# Altium project Li-ion_Battery_Charger.PrjPcb
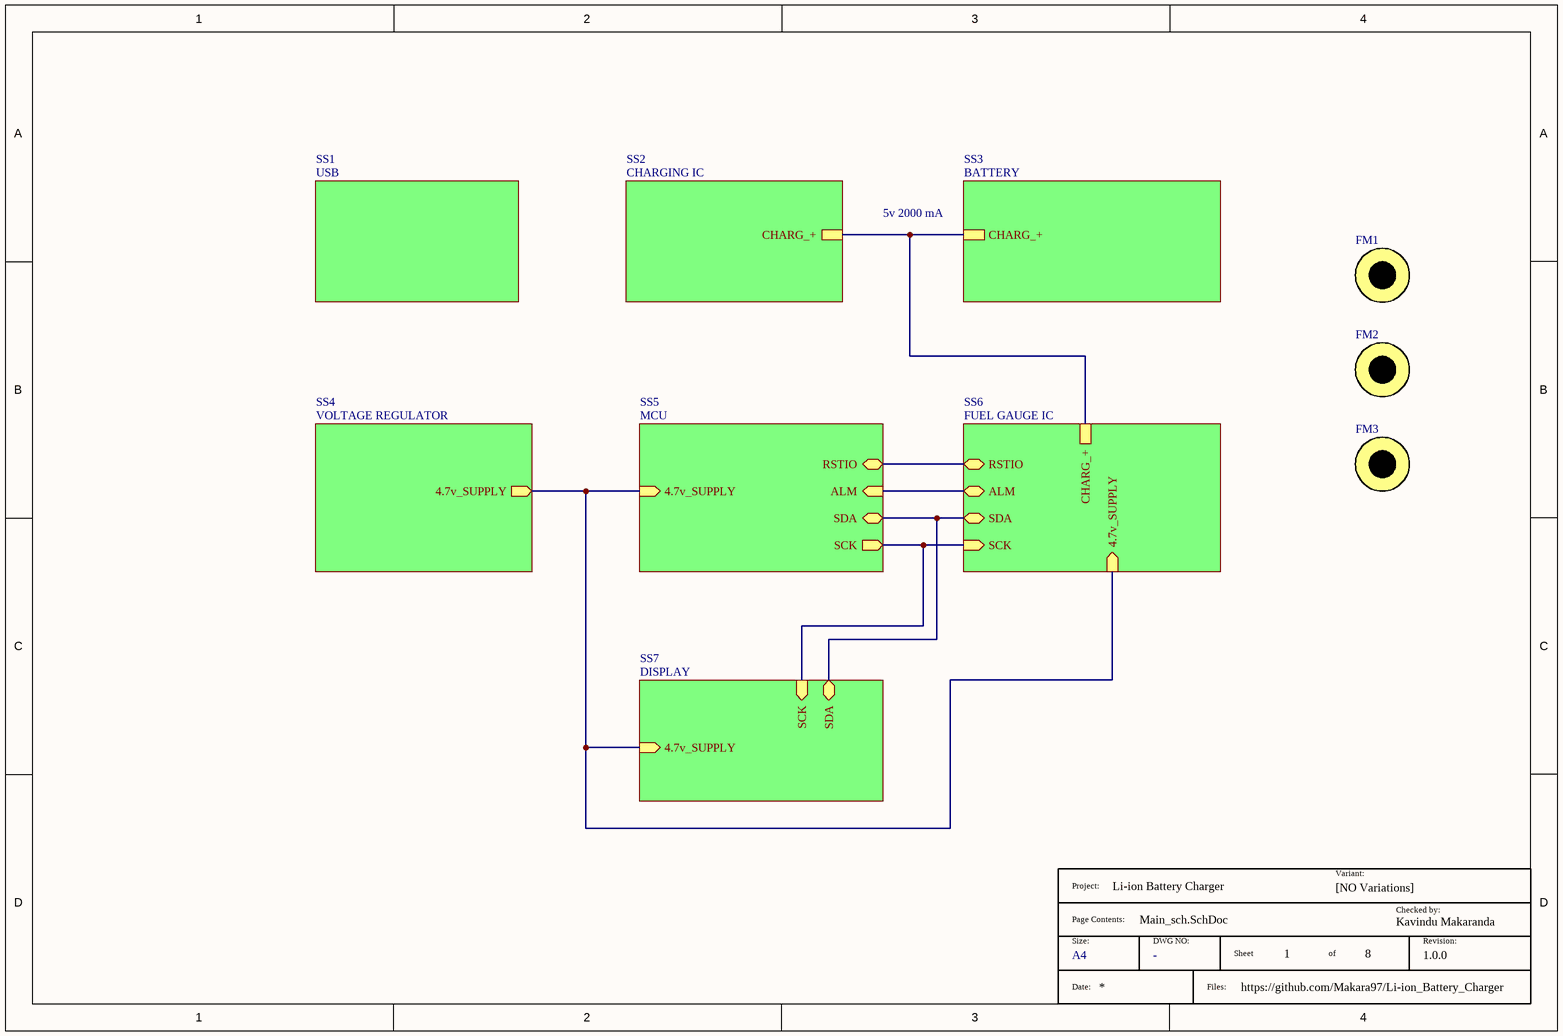
[diagram p0: Main_sch.SchDoc]
VersionRevision: 1.0.0; Project: Li-ion Battery Charger; DesignedByURL: https://github.com/Makara97/Li-ion_Battery_Charger
8 sheets, 47 parts. Net scope: hierarchical (ports join the sheet entries above them; power ports are global).
Board file: PCB.PcbDoc
Sheets:
  Main_sch.SchDoc
    SS1 = USB.SchDoc
    SS4 = VOLTAGE REGULATOR.SchDoc
    SS2 = CHARGING IC.SchDoc
    SS5 = MCU.SchDoc
    SS6 = FUEL GAUGE IC.SchDoc
    SS7 = DISPLAY.SchDoc
    SS3 = BATTERY.SchDoc

## Sheet Main_sch.SchDoc: Li-ion Battery Charger
size A4; Engineer: Kavindu Makaranda; Revision: 1.0.0; SheetNumber: 1; SheetTotal: 8

### Parts
*  Size: A4  (hidden comment: TitleBlock)  (graphical)
FM1  FIDUCIAL  [FIDUCIAL]  (value not drawn)
FM2  FIDUCIAL  [FIDUCIAL]  (value not drawn)
FM3  FIDUCIAL  [FIDUCIAL]  (value not drawn)

### Sub-sheets
SS1 = USB: no entries
SS2 = CHARGING IC: CHARG_+
SS3 = BATTERY: CHARG_+
SS4 = VOLTAGE REGULATOR: 4.7v_SUPPLY (out)
SS5 = MCU: SCK (out), SDA (bidir), ALM (in), RSTIO (bidir), 4.7v_SUPPLY (in)
SS6 = FUEL GAUGE IC: ALM (bidir), RSTIO (bidir), SDA (bidir), SCK (in), CHARG_+, 4.7v_SUPPLY (in)
SS7 = DISPLAY: 4.7v_SUPPLY (in), SCK (in), SDA (bidir)

### Nets
4.7v_SUPPLY: sheet SS4/4.7v_SUPPLY, sheet SS5/4.7v_SUPPLY, sheet SS6/4.7v_SUPPLY, sheet SS7/4.7v_SUPPLY
ALM: sheet SS5/ALM, sheet SS6/ALM
RSTIO: sheet SS5/RSTIO, sheet SS6/RSTIO
SCK: sheet SS5/SCK, sheet SS6/SCK, sheet SS7/SCK
SDA: sheet SS5/SDA, sheet SS6/SDA, sheet SS7/SDA
NetC2_2: sheet SS2/CHARG_+, sheet SS6/CHARG_+, sheet SS3/CHARG_+

### Notes on the sheet
- 5v 2000 mA
- THIS DOCUMENT AND THE DATA DISCLOSED HEREIN OR
- HEREWITH IS THE PROPERTY OF ALTIUM LIMITED AND MAY
- DWG NO:
- REVISION
- REV:
- DESCRIPTION
- DATE
- APPROVED
- BE FREELY DISTRIBUTED IN WHOLE. NO RIGHTS ARE
- RESERVED OR EXPRESS OR IMPLIED WARANTEE GIVEN.
- ENG:
- APPROVALS
- PROJECT
- DSN:
- CHK:
- REFERENCE DOCUMENTS
- PROJECT REVISION:
- TITLE
- DOCUMENT REVISION:
- DESIGN ITEM:
- BOM:
- FAB DWG:
- PCB DWG:
- ASSY DWG:
- SCALE:
- A3
- SIZE
- CAGE CODE
- FILE NAME
- DWG NO.
- SHEET
- OF
- REV
- (in symbol TitleBlock) Project:; Variant:; [NO Variations]; Checked by:; Page Contents:; Kavindu Makaranda; Size:; DWG NO:; Sheet; of; Revision:; Date:; Files:

### Library data of the parts
* = TitleBlock: Standard Title Block; DWG NO: -
FM1-FM3 = FM

## Sheet USB.SchDoc
size A4; SheetNumber: 2; SheetTotal: 8
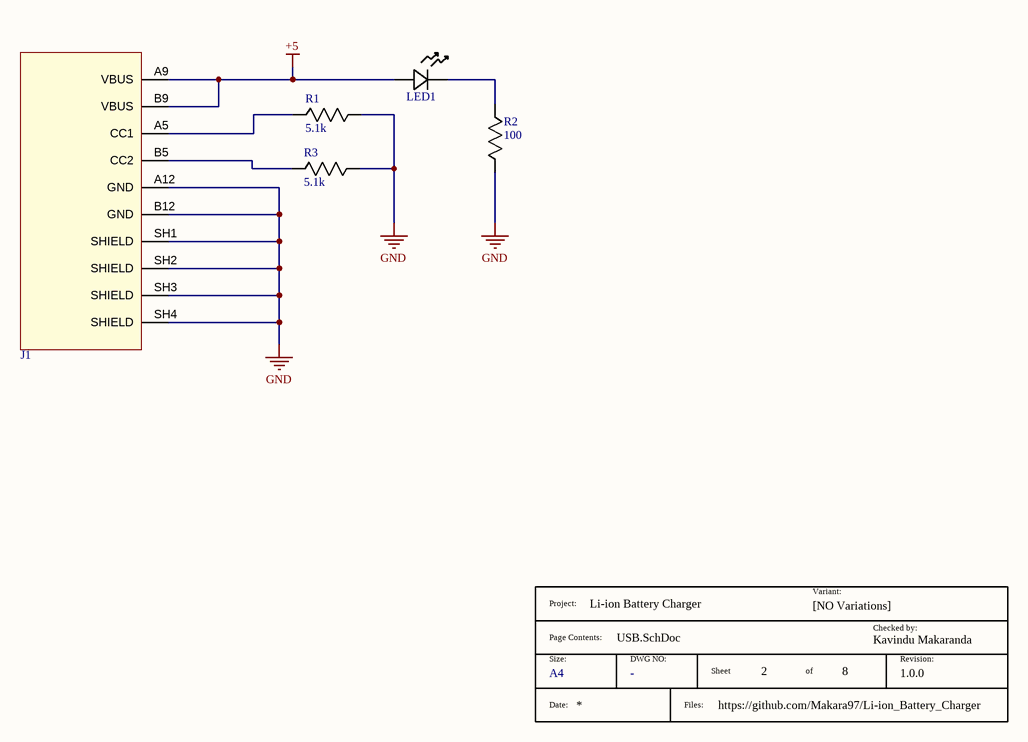
[diagram p1: USB.SchDoc]

### Parts
(Parts that share a designator on the sheet are numbered #1, #2 ... from top to bottom, then left to right.)
*?#1  Size: A4  (hidden comment: TitleBlock)  (graphical)
J1  USB_Type_C  [AMPHENOL_10174819-00011LF]  (value not drawn)
LED1  LED GREEN DIFFUSED 0603 SMD  [LED_B1931NG_HVK]  (value not drawn)
R1  5.1k  [RESC1608X55N]
R2  100  [RESC1608X55N]
R3  5.1k  [RESC1608X55N]

### Nets
+5: J1.A9(VBUS) J1.B9(VBUS) LED1.2(ANODE)
GND: J1.A12(GND) J1.B12(GND) J1.SH1(SHIELD) J1.SH2(SHIELD) J1.SH3(SHIELD) J1.SH4(SHIELD) R1.2 R2.1 R3.2
NetJ1_A5: J1.A5(CC1) R1.1
NetJ1_B5: J1.B5(CC2) R3.1
NetLED1_1: LED1.1(CATHODE) R2.2

### Notes on the sheet
- THIS DOCUMENT AND THE DATA DISCLOSED HEREIN OR
- HEREWITH IS THE PROPERTY OF ALTIUM LIMITED AND MAY
- DWG NO:
- REVISION
- REV:
- DESCRIPTION
- DATE
- APPROVED
- BE FREELY DISTRIBUTED IN WHOLE. NO RIGHTS ARE
- RESERVED OR EXPRESS OR IMPLIED WARANTEE GIVEN.
- ENG:
- APPROVALS
- PROJECT
- DSN:
- CHK:
- REFERENCE DOCUMENTS
- PROJECT REVISION:
- TITLE
- DOCUMENT REVISION:
- DESIGN ITEM:
- BOM:
- FAB DWG:
- PCB DWG:
- ASSY DWG:
- SCALE:
- A3
- SIZE
- CAGE CODE
- FILE NAME
- DWG NO.
- SHEET
- OF
- REV
- (in symbol TitleBlock) Project:; Variant:; [NO Variations]; Checked by:; Page Contents:; Kavindu Makaranda; Size:; DWG NO:; Sheet; of; Revision:; Date:; Files:

### Library data of the parts
*?#1 = TitleBlock: Standard Title Block; DWG NO: -
J1 = 10174819-00011LF: USB-C (USB TYPE-C) Receptacle Connector 24 (6+18 Dummy) Position Surface Mount, Right Angle; MF: Amphenol Communications Solutions-FCI; SnapEDA_Link: https://www.snapeda.com/parts/10174819-00011LF/Amphenol/view-part/?ref=snap; Package: None; Value: *; MP: 10174819-00011LF; Check_prices: https://www.snapeda.com/parts/10174819-00011LF/Amphenol/view-part/?ref=eda; Supplier 1: Digikey; Supplier Part Number 1: 609-10174819-00011LFCT-ND
LED1 = B1931NG--20D001114U1930: Mfr_Name: Harvatek; Type: LED Indication; Supplier 1: Digikey; Supplier Part Number 1: 3147-B1931NG--20D001114U1930CT-ND
R1 R3 = RC0603FR-075K1L: Resistor RC0603FR-075K1L; Manufacturer_Name: KEMET; Datasheet Link: http://www.yageo.com/documents/recent/PYu-RC0603_51_RoHS_L_v5.pdf; Height: 0.55mm; Manufacturer_Part_Number: RC0603FR-075K1L; Mouser Part Number: 603-RC0603FR-075K1L; Mouser Price/Stock: https://www.mouser.co.uk/ProductDetail/YAGEO/RC0603FR-075K1L?qs=gt6vzsuosg2jUUwxnI2PJQ%3D%3D; Arrow Part Number: RC0603FR-075K1L; Arrow Price/Stock: https://www.arrow.com/en/products/rc0603fr-075k1l/yageo?region=nac; Supplier 1: Digikey; Supplier Part Number 1: 311-5.10KHRCT-ND
R2 = ERJ-3EKF1000V: Resistor ERJ-3EKF1000V; Manufacturer_Name: Panasonic; Datasheet Link: http://industrial.panasonic.com/cdbs/www-data/pdf/RDA0000/AOA0000C86.pdf; Height: 0.55mm; Manufacturer_Part_Number: ERJ-3EKF1000V; Mouser Part Number: 667-ERJ-3EKF1000V; Mouser Price/Stock: https://www.mouser.co.uk/ProductDetail/Panasonic/ERJ-3EKF1000V?qs=H7k1u0Mp9JS7i8KGO5m47A%3D%3D; Arrow Part Number: ERJ-3EKF1000V; Arrow Price/Stock: https://www.arrow.com/en/products/erj-3ekf1000v/panasonic?utm_currency=USD&region=nac; Supplier 1: Mouser; Supplier Part Number 1: 667-ERJ-3EKF1000V

## Sheet VOLTAGE REGULATOR.SchDoc
size A4; SheetNumber: 5; SheetTotal: 8
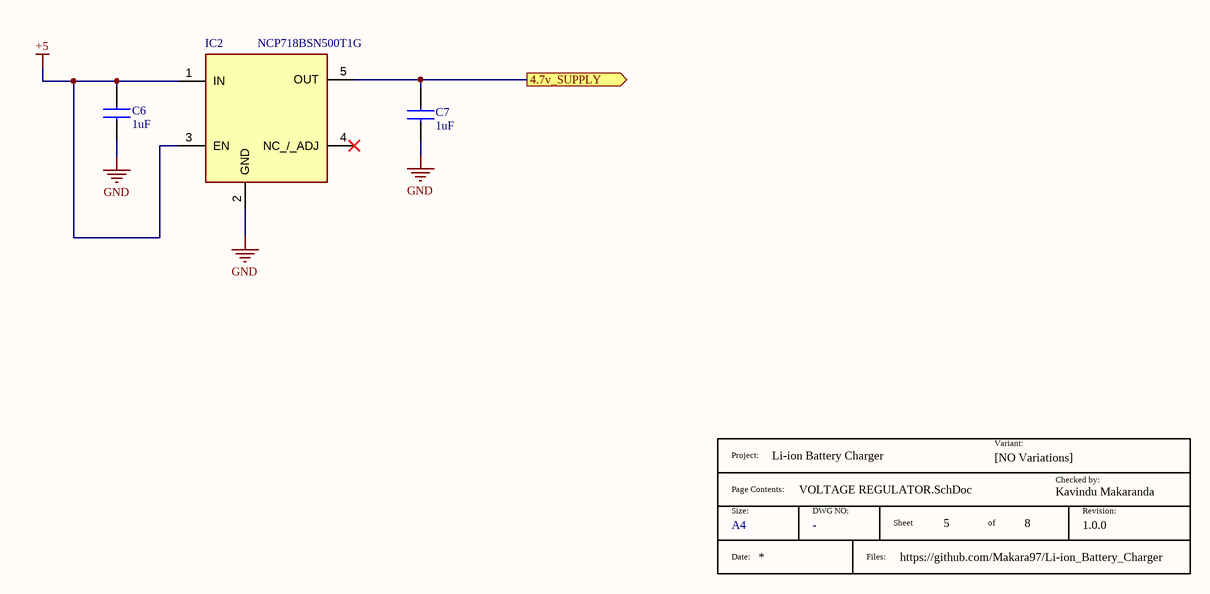
[diagram p2: VOLTAGE REGULATOR.SchDoc]

### Parts
(Parts that share a designator on the sheet are numbered #1, #2 ... from top to bottom, then left to right.)
*?#2  Size: A4  (hidden comment: TitleBlock)  (graphical)
C6  1uF  [CAPC1608X90N]
C7  1uF  [CAPC1608X90N]
IC2  NCP718BSN500T1G  [SOT95P280X100-5N]

### Ports
4.7v_SUPPLY (out, see Main_sch[2B], DISPLAY[2C], FUEL GAUGE IC[1B], MCU[3A])

### Nets
+5: C6.2 IC2.1(IN) IC2.3(EN)
GND: C6.1 C7.1 IC2.2(GND)
4.7v_SUPPLY: C7.2 IC2.5(OUT) ; port 4.7v_SUPPLY

Not connected (* = marked no-connect by the designer): IC2 4(NC_/_ADJ)*

### Notes on the sheet
- THIS DOCUMENT AND THE DATA DISCLOSED HEREIN OR
- HEREWITH IS THE PROPERTY OF ALTIUM LIMITED AND MAY
- DWG NO:
- REVISION
- REV:
- DESCRIPTION
- DATE
- APPROVED
- BE FREELY DISTRIBUTED IN WHOLE. NO RIGHTS ARE
- RESERVED OR EXPRESS OR IMPLIED WARANTEE GIVEN.
- ENG:
- APPROVALS
- PROJECT
- DSN:
- CHK:
- REFERENCE DOCUMENTS
- PROJECT REVISION:
- TITLE
- DOCUMENT REVISION:
- DESIGN ITEM:
- BOM:
- FAB DWG:
- PCB DWG:
- ASSY DWG:
- SCALE:
- A3
- SIZE
- CAGE CODE
- FILE NAME
- DWG NO.
- SHEET
- OF
- REV
- (in symbol TitleBlock) Project:; Variant:; [NO Variations]; Checked by:; Page Contents:; Kavindu Makaranda; Size:; DWG NO:; Sheet; of; Revision:; Date:; Files:

### Library data of the parts
*?#2 = TitleBlock: Standard Title Block; DWG NO: -
C6 C7 = CL10A105KO8NNNC: Manufacturer_Name: SAMSUNG; Datasheet Link: https://labcenter.componentsearchengine.com/Datasheets/2/CL10A105KO8NNNC.pdf; Height: 0.9mm; Manufacturer_Part_Number: CL10A105KO8NNNC; Mouser Part Number: 187-CL10A105KO8NNNC; Mouser Price/Stock: https://www.mouser.co.uk/ProductDetail/Samsung-Electro-Mechanics/CL10A105KO8NNNC?qs=hqM3L16%252BxlfR4qamq4FMLg%3D%3D; Arrow Part Number: CL10A105KO8NNNC; Arrow Price/Stock: https://www.arrow.com/en/products/cl10a105ko8nnnc/samsung-electro-mechanics?utm_currency=USD&region=nac; Supplier 1: Digikey; Supplier Part Number 1: 1276-1034-1-ND
IC2 = NCP718BSN500T1G: Integrated Circuit; Manufacturer_Name: onsemi; Datasheet Link: https://www.onsemi.com/pub/Collateral/NCP718-D.PDF; Height: 1mm; Manufacturer_Part_Number: NCP718BSN500T1G; Mouser Part Number: 863-NCP718BSN500T1G; Mouser Price/Stock: https://www.mouser.co.uk/ProductDetail/onsemi/NCP718BSN500T1G?qs=MLItCLRbWsy0K4chDaw%252BGA%3D%3D; Arrow Part Number: NCP718BSN500T1G; Arrow Price/Stock: https://www.arrow.com/en/products/ncp718bsn500t1g/on-semiconductor?region=nac; Supplier 1: Arrow Electronics; Supplier Part Number 1: NCP718BSN500T1G

## Sheet CHARGING IC.SchDoc
size A4; SheetNumber: 3; SheetTotal: 8
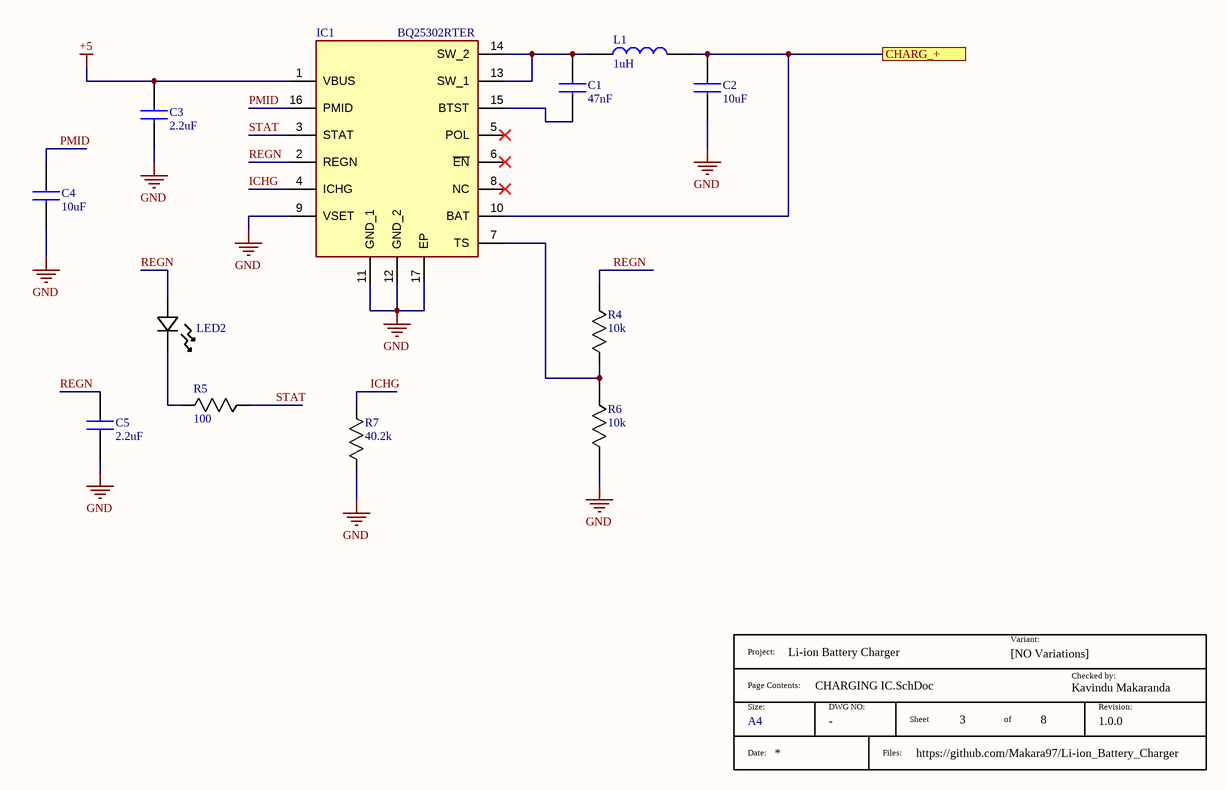
[diagram p3: CHARGING IC.SchDoc]

### Parts
(Parts that share a designator on the sheet are numbered #1, #2 ... from top to bottom, then left to right.)
*?#3  Size: A4  (hidden comment: TitleBlock)  (graphical)
C1  47nF  [C0603]
C2  10uF  [CAPC1608X90N]
C3  2.2uF  [CAPC1608X90N]
C4  10uF  [CAPC1608X90N]
C5  2.2uF  [CAPC1608X90N]
IC1  BQ25302RTER  [QFN50P300X300X80-17N-D]
L1  1uH  [INDC2016X100N]
LED2  LED GREEN DIFFUSED 0603 SMD  [LED_B1931NG_HVK]  (value not drawn)
R4  10k  [RESC1608X55N]
R5  100  [RESC1608X55N]
R6  10k  [RESC1608X55N]
R7  40.2k  [STA_RMCF0805_STP-L]

### Ports
CHARG_+ (see Main_sch[3A], BATTERY[2B], FUEL GAUGE IC[4B])

### Nets
+5: C3.2 IC1.1(VBUS)
GND: C2.1 C3.1 C4.1 C5.1 IC1.9(VSET) IC1.11(GND_1) IC1.12(GND_2) IC1.17(EP) R6.1 R7.1
ICHG: IC1.4(ICHG) R7.2
PMID: C4.2 IC1.16(PMID)
REGN: C5.2 IC1.2(REGN) LED2.2(ANODE) R4.2
STAT: IC1.3(STAT) R5.2
NetC1_1: C1.1 IC1.15(BTST)
NetC1_2: C1.2 IC1.13(SW_1) IC1.14(SW_2) L1.1
NetC2_2: C2.2 IC1.10(BAT) L1.2 ; port CHARG_+
NetIC1_7: IC1.7(TS) R4.1 R6.2
NetLED2_1: LED2.1(CATHODE) R5.1

Not connected (* = marked no-connect by the designer): IC1 5(POL)* 6(~{EN})* 8(NC)*

### Notes on the sheet
- THIS DOCUMENT AND THE DATA DISCLOSED HEREIN OR
- HEREWITH IS THE PROPERTY OF ALTIUM LIMITED AND MAY
- DWG NO:
- REVISION
- REV:
- DESCRIPTION
- DATE
- APPROVED
- BE FREELY DISTRIBUTED IN WHOLE. NO RIGHTS ARE
- RESERVED OR EXPRESS OR IMPLIED WARANTEE GIVEN.
- ENG:
- APPROVALS
- PROJECT
- DSN:
- CHK:
- REFERENCE DOCUMENTS
- PROJECT REVISION:
- TITLE
- DOCUMENT REVISION:
- DESIGN ITEM:
- BOM:
- FAB DWG:
- PCB DWG:
- ASSY DWG:
- SCALE:
- A3
- SIZE
- CAGE CODE
- FILE NAME
- DWG NO.
- SHEET
- OF
- REV
- (in symbol TitleBlock) Variant:; Project:; [NO Variations]; Checked by:; Page Contents:; Kavindu Makaranda; Size:; DWG NO:; Revision:; Sheet; of; Date:; Files:

### Library data of the parts
*?#3 = TitleBlock: Standard Title Block; DWG NO: -
C1 = C0603C473K4RECAUTO: Manufacturer_Name: KEMET; Datasheet Link: https://content.kemet.com/datasheets/KEM_C1090_X7R_ESD.pdf; Height: 0.87mm; Manufacturer_Part_Number: C0603C473K4RECAUTO; Mouser Part Number: 80-C0603C473K4RECAUT; Mouser Price/Stock: https://www.mouser.co.uk/ProductDetail/KEMET/C0603C473K4RECAUTO?qs=MLItCLRbWsx7WtjsOHG43w%3D%3D; Supplier 1: Arrow Electronics; Supplier Part Number 1: C0603C473K4RECAUTO
C2 C4 = CL10A106KQ8NNNC: Manufacturer_Name: SAMSUNG; Datasheet Link: https://ms.componentsearchengine.com/Datasheets/2/CL10A106KQ8NNNC.pdf; Height: 0.9mm; Manufacturer_Part_Number: CL10A106KQ8NNNC; Mouser Part Number: 187-CL10A106KQ8NNNC; Mouser Price/Stock: https://www.mouser.co.uk/ProductDetail/Samsung-Electro-Mechanics/CL10A106KQ8NNNC?qs=349EhDEZ59o8RdV9CD4bGw%3D%3D; Arrow Part Number: CL10A106KQ8NNNC; Arrow Price/Stock: https://www.arrow.com/en/products/cl10a106kq8nnnc/samsung-electro-mechanics?utm_currency=USD&region=nac; Supplier 1: Digikey; Supplier Part Number 1: 1276-1038-1-ND
C3 C5 = CL10A225KO8NNNC: Manufacturer_Name: SAMSUNG; Datasheet Link: https://lcsc.componentsearchengine.com/Datasheets/2/CL10A225KO8NNNC.pdf; Height: 0.9mm; Manufacturer_Part_Number: CL10A225KO8NNNC; Mouser Part Number: 187-CL10A225KO8NNNC; Mouser Price/Stock: https://www.mouser.co.uk/ProductDetail/Samsung-Electro-Mechanics/CL10A225KO8NNNC?qs=hqM3L16%252BxlecoJxUp5hKOw%3D%3D; Arrow Part Number: CL10A225KO8NNNC; Arrow Price/Stock: https://www.arrow.com/en/products/cl10a225ko8nnnc/samsung-electro-mechanics?region=europe; Supplier 1: Digikey; Supplier Part Number 1: 1276-1040-1-ND
IC1 = BQ25302RTER: Integrated Circuit; Manufacturer_Name: Texas Instruments; Datasheet Link: https://www.ti.com/lit/gpn/bq25302?HQS=ti-null-null-sf-df-pf-sep-wwe&DCM=yes; Height: 0.8mm; Manufacturer_Part_Number: BQ25302RTER; Mouser Part Number: 595-BQ25302RTER; Mouser Price/Stock: https://www.mouser.co.uk/ProductDetail/Texas-Instruments/BQ25302RTER?qs=T94vaHKWudT5T0v43I60Mg%3D%3D; Arrow Part Number: BQ25302RTER; Arrow Price/Stock: null?region=nac; Supplier 1: Mouser; Supplier Part Number 1: 595-BQ25302RTER
L1 = CIGT201610LH1R0MNE: Manufacturer_Name: SAMSUNG; Datasheet Link: https://datasheet.datasheetarchive.com/originals/distributors/DKDS-19/372470.pdf; Height: 1mm; Manufacturer_Part_Number: CIGT201610LH1R0MNE; Mouser Part Number: 187-CIGT201610LH1R0M; Mouser Price/Stock: https://www.mouser.co.uk/ProductDetail/Samsung-Electro-Mechanics/CIGT201610LH1R0MNE?qs=xZ%2FP%252Ba9zWqYdDsZ4M%252BqcTg%3D%3D; Arrow Part Number: CIGT201610LH1R0MNE; Arrow Price/Stock: https://www.arrow.com/en/products/cigt201610lh1r0mne/samsung-electro-mechanics?utm_currency=USD&region=nac; Supplier 1: Digikey; Supplier Part Number 1: 1276-6910-1-ND
LED2 = B1931NG--20D001114U1930: Mfr_Name: Harvatek; Type: LED Indication; Supplier 1: Digikey; Supplier Part Number 1: 3147-B1931NG--20D001114U1930CT-ND
R4 R6 = RK73H1JTTD1002F: Manufacturer_Name: KOA Speer; Datasheet Link: http://www.koaspeer.com/catimages/Products/RK73-RT/RK73-RT.pdf; Height: 0.55mm; Manufacturer_Part_Number: RK73H1JTTD1002F; Mouser Part Number: 660-RK73H1JTTD1002F; Mouser Price/Stock: https://www.mouser.co.uk/ProductDetail/KOA-Speer/RK73H1JTTD1002F?qs=%252BHd4ebZ%252Bq6V15kIYdKv25A%3D%3D; Arrow Part Number: RK73H1JTTD1002F; Arrow Price/Stock: https://www.arrow.com/en/products/rk73h1jttd1002f/koa-speer-electronics?region=nac; Supplier 1: Digikey; Supplier Part Number 1: 2019-RK73H1JTTD1002FCT-ND
R5 = ERJ-3EKF1000V: as R2 on sheet USB; Datasheet Link: http://industrial.panasonic.com/cdbs/www-data/pdf/RDA0000/AOA0000C86.pdf; Height: 0.55mm; Manufacturer_Part_Number: ERJ-3EKF1000V; Mouser Part Number: 667-ERJ-3EKF1000V; Mouser Price/Stock: https://www.mouser.co.uk/ProductDetail/Panasonic/ERJ-3EKF1000V?qs=H7k1u0Mp9JS7i8KGO5m47A%3D%3D; Arrow Part Number: ERJ-3EKF1000V; Arrow Price/Stock: https://www.arrow.com/en/products/erj-3ekf1000v/panasonic?utm_currency=USD&region=nac; Supplier 1: Mouser; Supplier Part Number 1: 667-ERJ-3EKF1000V
R7 = RMCF0805FT40K2: Mfr_Name: Stackpole International; Supplier 1: Digikey; Supplier Part Number 1: RMCF0805FT40K2CT-ND

## Sheet MCU.SchDoc
size A4; SheetNumber: 8; SheetTotal: 8
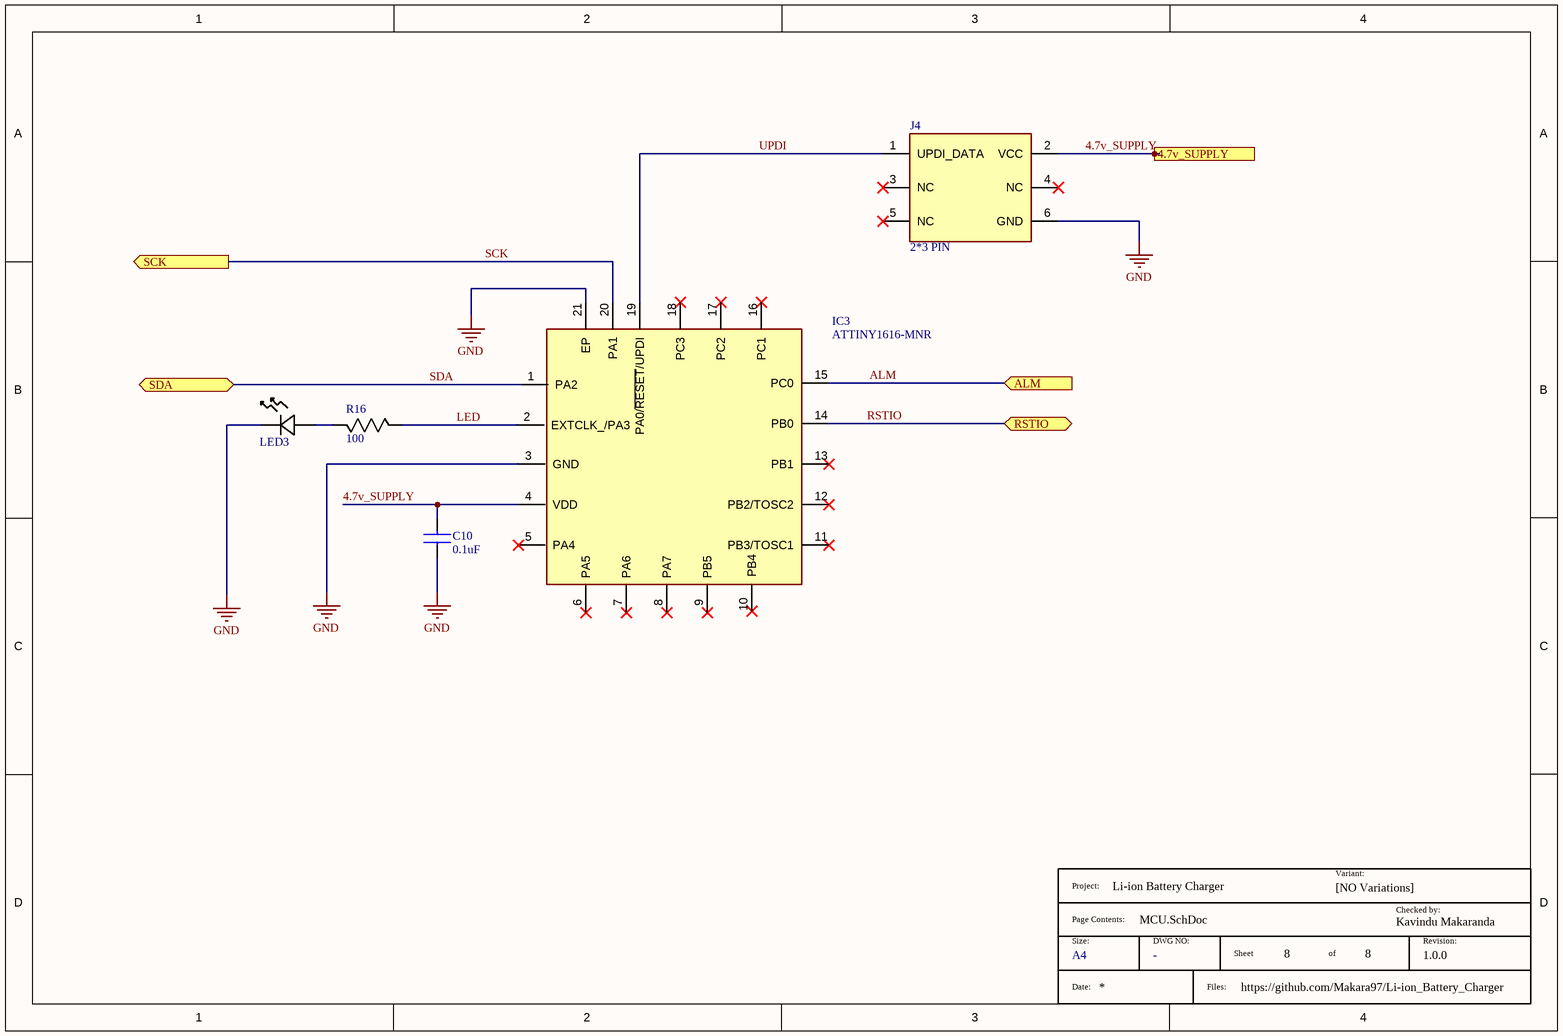
[diagram p4: MCU.SchDoc]

### Parts
(Parts that share a designator on the sheet are numbered #1, #2 ... from top to bottom, then left to right.)
*?#4  Size: A4  (hidden comment: TitleBlock)  (graphical)
C10  0.1uF  [C0603]
IC3  ATTINY1616-MNR  [QFN40P300X300X90-21N]
J4  2*3 PIN  [HDRV6W64P254_2X3_762X508X868P]
LED3  LED GREEN DIFFUSED 0603 SMD  [LED_B1931NG_HVK]  (value not drawn)
R16  100  [RESC1608X55N]

### Ports
4.7v_SUPPLY (in, see Main_sch[2B], DISPLAY[2C], FUEL GAUGE IC[1B], VOLTAGE REGULATOR[3B]), ALM (in, see Main_sch[3B], FUEL GAUGE IC[1B]), RSTIO (bidir, see Main_sch[3B], FUEL GAUGE IC[1C]), SCK (out, see Main_sch[3C], DISPLAY[2B], FUEL GAUGE IC[1B]), SDA (bidir, see Main_sch[3C], DISPLAY[2B], FUEL GAUGE IC[1B])

### Nets
GND: C10.1 IC3.3(GND) IC3.21(EP) J4.6(GND) LED3.1(CATHODE)
4.7v_SUPPLY: C10.2 IC3.4(VDD) J4.2(VCC) ; port 4.7v_SUPPLY
ALM: IC3.15(PC0) ; port ALM
LED: IC3.2(EXTCLK_/PA3) R16.1
RSTIO: IC3.14(PB0) ; port RSTIO
SCK: IC3.20(PA1) ; port SCK
SDA: IC3.1(PA2) ; port SDA
UPDI: IC3.19(PA0/~{RESET}/UPDI) J4.1(UPDI_DATA)
NetLED3_2: LED3.2(ANODE) R16.2

Not connected (* = marked no-connect by the designer): IC3 5(PA4)* 6(PA5)* 7(PA6)* 8(PA7)* 9(PB5)* 10(PB4)* 11(PB3/TOSC1)* 12(PB2/TOSC2)* 13(PB1)* 16(PC1)* 17(PC2)* 18(PC3)*; J4 3(NC)* 4(NC)* 5(NC)*

### Notes on the sheet
- THIS DOCUMENT AND THE DATA DISCLOSED HEREIN OR
- HEREWITH IS THE PROPERTY OF ALTIUM LIMITED AND MAY
- DWG NO:
- REVISION
- REV:
- DESCRIPTION
- DATE
- APPROVED
- BE FREELY DISTRIBUTED IN WHOLE. NO RIGHTS ARE
- RESERVED OR EXPRESS OR IMPLIED WARANTEE GIVEN.
- ENG:
- APPROVALS
- PROJECT
- DSN:
- CHK:
- REFERENCE DOCUMENTS
- PROJECT REVISION:
- TITLE
- DOCUMENT REVISION:
- DESIGN ITEM:
- BOM:
- FAB DWG:
- PCB DWG:
- ASSY DWG:
- SCALE:
- A3
- SIZE
- CAGE CODE
- FILE NAME
- DWG NO.
- SHEET
- OF
- REV
- (in symbol TitleBlock) Project:; Variant:; [NO Variations]; Checked by:; Page Contents:; Kavindu Makaranda; Size:; DWG NO:; Sheet; of; Revision:; Date:; Files:

### Library data of the parts
*?#4 = TitleBlock: Standard Title Block; DWG NO: -
C10 = C0603C104K3RACTU: Capacitor C0603C104K3RACTU; Manufacturer_Name: KEMET; Datasheet Link: https://content.kemet.com/datasheets/KEM_C1002_X7R_SMD.pdf; Height: 0.87mm; Manufacturer_Part_Number: C0603C104K3RACTU; Mouser Part Number: 80-C0603C104K3R; Mouser Price/Stock: https://www.mouser.co.uk/ProductDetail/KEMET/C0603C104K3RACTU?qs=l5k%252BbMnNDklvfdneglCDAg%3D%3D; Arrow Part Number: C0603C104K3RACTU; Arrow Price/Stock: https://www.arrow.com/en/products/c0603c104k3ractu/kemet-corporation?utm_currency=USD&region=nac; Supplier 1: Arrow Electronics; Supplier Part Number 1: C0603C104K3RACTU
IC3 = ATTINY1616-MNR: Integrated Circuit ATTINY1616-MNR; Manufacturer_Name: Microchip; Datasheet Link: https://datasheet.datasheetarchive.com/originals/distributors/DKDS41/DSANUWW0026757.pdf; Height: 0.9mm; Manufacturer_Part_Number: ATTINY1616-MNR; Mouser Part Number: 556-ATTINY1616MNR; Mouser Price/Stock: https://www.mouser.co.uk/ProductDetail/Microchip-Technology/ATTINY1616-MNR?qs=HXFqYaX1Q2yKNpuKQU9qww%3D%3D; Arrow Part Number: ATTINY1616-MNR; Arrow Price/Stock: https://www.arrow.com/en/products/attiny1616-mnr/microchip-technology?utm_currency=USD&region=nac; Supplier 1: Digikey; Supplier Part Number 1: ATTINY1616-MNRCT-ND
J4 = M20-9980346: Connector; Manufacturer_Name: Harwin; Datasheet Link: https://cdn.harwin.com/pdfs/M20-998.pdf; Height: 8.68mm; Manufacturer_Part_Number: M20-9980346; Mouser Part Number: 855-M20-9980346; Mouser Price/Stock: https://www.mouser.co.uk/ProductDetail/Harwin/M20-9980346?qs=%252Bk6%2F5FB6qrmHk2P20oz3FA%3D%3D; Supplier 1: Digikey; Supplier Part Number 1: 952-2121-ND
LED3 = B1931NG--20D001114U1930: Mfr_Name: Harvatek; Type: LED Indication; Supplier 1: Digikey; Supplier Part Number 1: 3147-B1931NG--20D001114U1930CT-ND
R16 = ERJ-3EKF1000V: as R2 on sheet USB; Datasheet Link: http://industrial.panasonic.com/cdbs/www-data/pdf/RDA0000/AOA0000C86.pdf; Height: 0.55mm; Manufacturer_Part_Number: ERJ-3EKF1000V; Mouser Part Number: 667-ERJ-3EKF1000V; Mouser Price/Stock: https://www.mouser.co.uk/ProductDetail/Panasonic/ERJ-3EKF1000V?qs=H7k1u0Mp9JS7i8KGO5m47A%3D%3D; Arrow Part Number: ERJ-3EKF1000V; Arrow Price/Stock: https://www.arrow.com/en/products/erj-3ekf1000v/panasonic?utm_currency=USD&region=nac; Supplier 1: Mouser; Supplier Part Number 1: 667-ERJ-3EKF1000V

## Sheet FUEL GAUGE IC.SchDoc
size A4; SheetNumber: 7; SheetTotal: 8
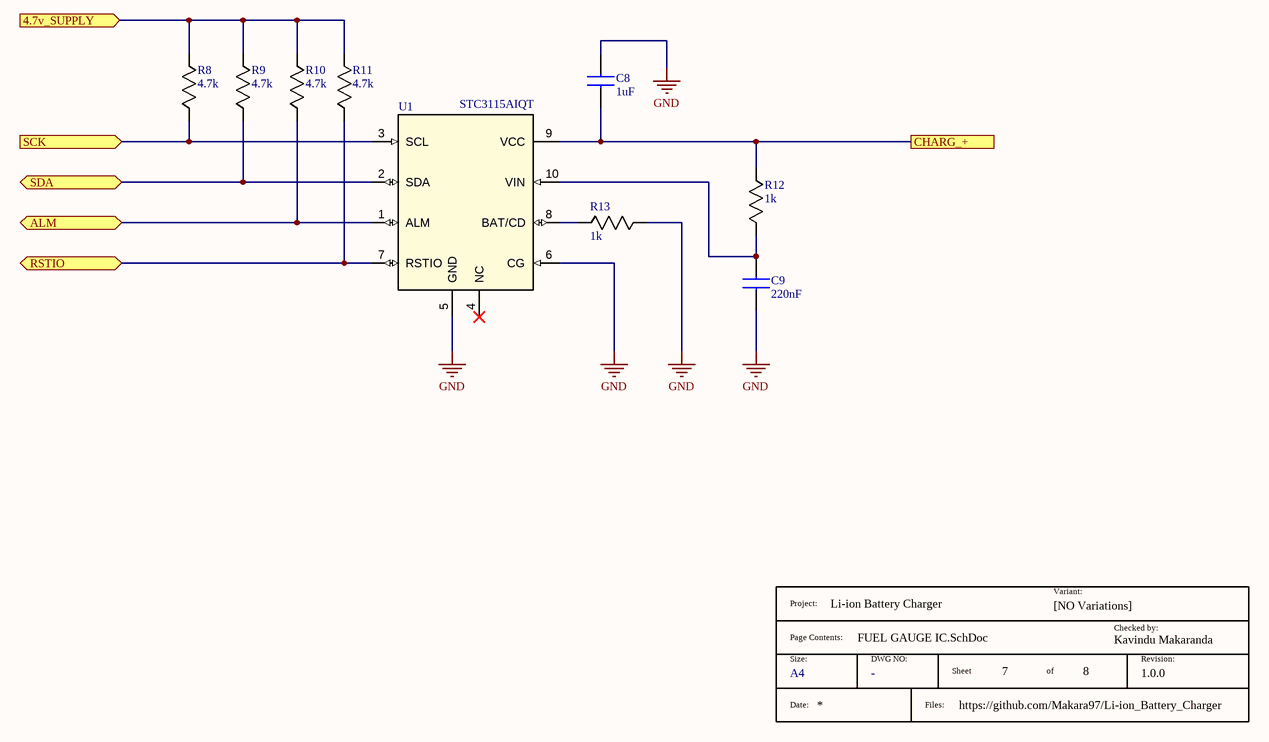
[diagram p5: FUEL GAUGE IC.SchDoc]

### Parts
(Parts that share a designator on the sheet are numbered #1, #2 ... from top to bottom, then left to right.)
*?#5  Size: A4  (hidden comment: TitleBlock)  (graphical)
C8  1uF  [CAPC1608X90N]
C9  220nF  [C0603]
R8  4.7k  [RESC1608X55N]
R9  4.7k  [RESC1608X55N]
R10  4.7k  [RESC1608X55N]
R11  4.7k  [RESC1608X55N]
R12  1k  [RESC1608X55N]
R13  1k  [RESC1608X55N]
U1  STC3115AIQT  [DFN10_2X3_STM]

### Ports
4.7v_SUPPLY (in, see Main_sch[3C], DISPLAY[2C], MCU[3A], VOLTAGE REGULATOR[3B]), ALM (bidir, see Main_sch[3B], MCU[3B]), CHARG_+ (see Main_sch[3B], BATTERY[2B], CHARGING IC[4B]), RSTIO (bidir, see Main_sch[3B], MCU[3B]), SCK (in, see Main_sch[3C], DISPLAY[2B], MCU[1B]), SDA (bidir, see Main_sch[3C], DISPLAY[2B], MCU[1B])

### Nets
GND: C8.2 C9.1 R13.2 U1.5(GND) U1.6(CG)
4.7v_SUPPLY: R8.2 R9.2 R10.2 R11.2 ; port 4.7v_SUPPLY
ALM: R10.1 U1.1(ALM) ; port ALM
RSTIO: R11.1 U1.7(RSTIO) ; port RSTIO
SCK: R8.1 U1.3(SCL) ; port SCK
SDA: R9.1 U1.2(SDA) ; port SDA
NetC2_2: C8.1 R12.2 U1.9(VCC) ; port CHARG_+
NetC9_2: C9.2 R12.1 U1.10(VIN)
NetR13_1: R13.1 U1.8(BAT/CD)

Not connected (* = marked no-connect by the designer): U1 4(NC)*

### Notes on the sheet
- THIS DOCUMENT AND THE DATA DISCLOSED HEREIN OR
- HEREWITH IS THE PROPERTY OF ALTIUM LIMITED AND MAY
- DWG NO:
- REVISION
- REV:
- DESCRIPTION
- DATE
- APPROVED
- BE FREELY DISTRIBUTED IN WHOLE. NO RIGHTS ARE
- RESERVED OR EXPRESS OR IMPLIED WARANTEE GIVEN.
- ENG:
- APPROVALS
- PROJECT
- DSN:
- CHK:
- REFERENCE DOCUMENTS
- PROJECT REVISION:
- TITLE
- DOCUMENT REVISION:
- DESIGN ITEM:
- BOM:
- FAB DWG:
- PCB DWG:
- ASSY DWG:
- SCALE:
- A3
- SIZE
- CAGE CODE
- FILE NAME
- DWG NO.
- SHEET
- OF
- REV
- (in symbol TitleBlock) Project:; Variant:; [NO Variations]; Checked by:; Page Contents:; Kavindu Makaranda; Size:; DWG NO:; Sheet; of; Revision:; Date:; Files:

### Library data of the parts
*?#5 = TitleBlock: Standard Title Block; DWG NO: -
C8 = CL10A105KO8NNNC: Manufacturer_Name: SAMSUNG; Datasheet Link: https://labcenter.componentsearchengine.com/Datasheets/2/CL10A105KO8NNNC.pdf; Height: 0.9mm; Manufacturer_Part_Number: CL10A105KO8NNNC; Mouser Part Number: 187-CL10A105KO8NNNC; Mouser Price/Stock: https://www.mouser.co.uk/ProductDetail/Samsung-Electro-Mechanics/CL10A105KO8NNNC?qs=hqM3L16%252BxlfR4qamq4FMLg%3D%3D; Arrow Part Number: CL10A105KO8NNNC; Arrow Price/Stock: https://www.arrow.com/en/products/cl10a105ko8nnnc/samsung-electro-mechanics?utm_currency=USD&region=nac; Supplier 1: Digikey; Supplier Part Number 1: 1276-1034-1-ND
C9 = C0603C224K4RECAUTO: Capacitor C0603C224K4RECAUTO; Manufacturer_Name: KEMET; Datasheet Link: https://content.kemet.com/datasheets/KEM_C1090_X7R_ESD.pdf; Height: 0.87mm; Manufacturer_Part_Number: C0603C224K4RECAUTO; Mouser Part Number: 80-C0603C224K4RECAUT; Mouser Price/Stock: https://www.mouser.co.uk/ProductDetail/KEMET/C0603C224K4RECAUTO?qs=MLItCLRbWszB36u3S8vAZQ%3D%3D; Arrow Part Number: C0603C224K4RECAUTO; Arrow Price/Stock: https://www.arrow.com/en/products/c0603c224k4recauto/kemet-corporation?region=nac; Supplier 1: Arrow Electronics; Supplier Part Number 1: C0603C224K4RECAUTO
R8-R11 = RC0603FR-074K7L: Resistor RC0603FR-074K7L; Manufacturer_Name: YAGEO; Datasheet Link: https://componentsearchengine.com/Datasheets/2/RC0603FR-074K7L.pdf; Height: 0.55mm; Manufacturer_Part_Number: RC0603FR-074K7L; Mouser Part Number: 603-RC0603FR-074K7L; Mouser Price/Stock: https://www.mouser.co.uk/ProductDetail/YAGEO/RC0603FR-074K7L?qs=gt6vzsuosg37y0l7Vt36bQ%3D%3D; Arrow Part Number: RC0603FR-074K7L; Arrow Price/Stock: https://www.arrow.com/en/products/rc0603fr-074k7l/yageo?utm_currency=USD&region=europe; Supplier 1: Future Electronics; Supplier Part Number 1: 5489695
R12 R13 = RMCF0603FT1K00: Manufacturer_Name: Stackpole Electronics; Datasheet Link: https://www.seielect.com/Catalog/SEI-RMCF_RMCP.pdf; Height: 0.55mm; Manufacturer_Part_Number: RMCF0603FT1K00; Mouser Part Number: 708-RMCF0603FT1K00; Mouser Price/Stock: https://www.mouser.co.uk/ProductDetail/SEI-Stackpole/RMCF0603FT1K00?qs=FESYatJ8odI%252BYiPlprc1Pg%3D%3D; Arrow Part Number: RMCF0603FT1K00; Arrow Price/Stock: https://www.arrow.com/en/products/rmcf0603ft1k00/stackpole-electronics?utm_currency=USD&region=nac; Supplier 1: Digikey; Supplier Part Number 1: RMCF0603FT1K00CT-ND
U1 = STC3115AIQT: STC3115AIQT Fuel Gauge IC; Mfr_Name: STMicroelectronics; RefDes: RefDes; Type: Type; Supplier 1: Arrow Electronics; Supplier Part Number 1: STC3115AIQT

## Sheet DISPLAY.SchDoc
size A4; SheetNumber: 6; SheetTotal: 8
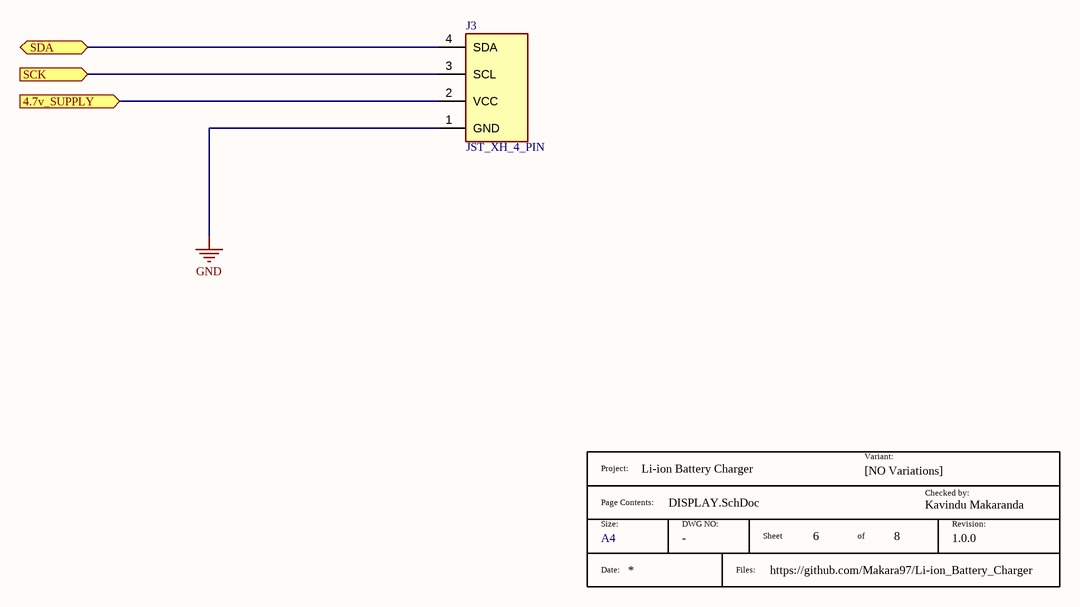
[diagram p6: DISPLAY.SchDoc]

### Parts
(Parts that share a designator on the sheet are numbered #1, #2 ... from top to bottom, then left to right.)
*?#6  Size: A4  (hidden comment: TitleBlock)  (graphical)
J3  JST_XH_4_PIN  [B4BXHALFSN]

### Ports
4.7v_SUPPLY (in, see Main_sch[2C], FUEL GAUGE IC[1B], MCU[3A], VOLTAGE REGULATOR[3B]), SCK (in, see Main_sch[3C], FUEL GAUGE IC[1B], MCU[1B]), SDA (bidir, see Main_sch[3C], FUEL GAUGE IC[1B], MCU[1B])

### Nets
GND: J3.1(GND)
4.7v_SUPPLY: J3.2(VCC) ; port 4.7v_SUPPLY
SCK: J3.3(SCL) ; port SCK
SDA: J3.4(SDA) ; port SDA

### Notes on the sheet
- THIS DOCUMENT AND THE DATA DISCLOSED HEREIN OR
- HEREWITH IS THE PROPERTY OF ALTIUM LIMITED AND MAY
- DWG NO:
- REVISION
- REV:
- DESCRIPTION
- DATE
- APPROVED
- BE FREELY DISTRIBUTED IN WHOLE. NO RIGHTS ARE
- RESERVED OR EXPRESS OR IMPLIED WARANTEE GIVEN.
- ENG:
- APPROVALS
- PROJECT
- DSN:
- CHK:
- REFERENCE DOCUMENTS
- PROJECT REVISION:
- TITLE
- DOCUMENT REVISION:
- DESIGN ITEM:
- BOM:
- FAB DWG:
- PCB DWG:
- ASSY DWG:
- SCALE:
- A3
- SIZE
- CAGE CODE
- FILE NAME
- DWG NO.
- SHEET
- OF
- REV
- (in symbol TitleBlock) Project:; Variant:; [NO Variations]; Checked by:; Page Contents:; Kavindu Makaranda; Size:; DWG NO:; Sheet; of; Revision:; Date:; Files:

### Library data of the parts
*?#6 = TitleBlock: Standard Title Block; DWG NO: -
J3 = B4B-XH-A_LF__SN_: Connector; Manufacturer_Name: JST (JAPAN SOLDERLESS TERMINALS); Manufacturer_Part_Number: B4B-XH-A(LF)(SN); Datasheet Link: https://datasheet.lcsc.com/szlcsc/JST-Sales-America-B4B-XH-A-LF-SN_C144395.pdf; Height: 7mm; Mouser Part Number: 306-B4BXHALFSN; Mouser Price/Stock: https://www.mouser.co.uk/ProductDetail/JST-Commercial/B4B-XH-ALFSN?qs=cdbOS8ANM9CfC08d%252BywhFw%3D%3D; Arrow Part Number: B4B-XH-A(LF)(SN); Arrow Price/Stock: https://www.arrow.com/en/products/b4b-xh-a-lf-sn/jst-manufacturing?utm_currency=USD&region=europe; Supplier 1: Mouser; Supplier Part Number 1: 306-B4BXHALFSN

## Sheet BATTERY.SchDoc
size A4; SheetNumber: 4; SheetTotal: 8
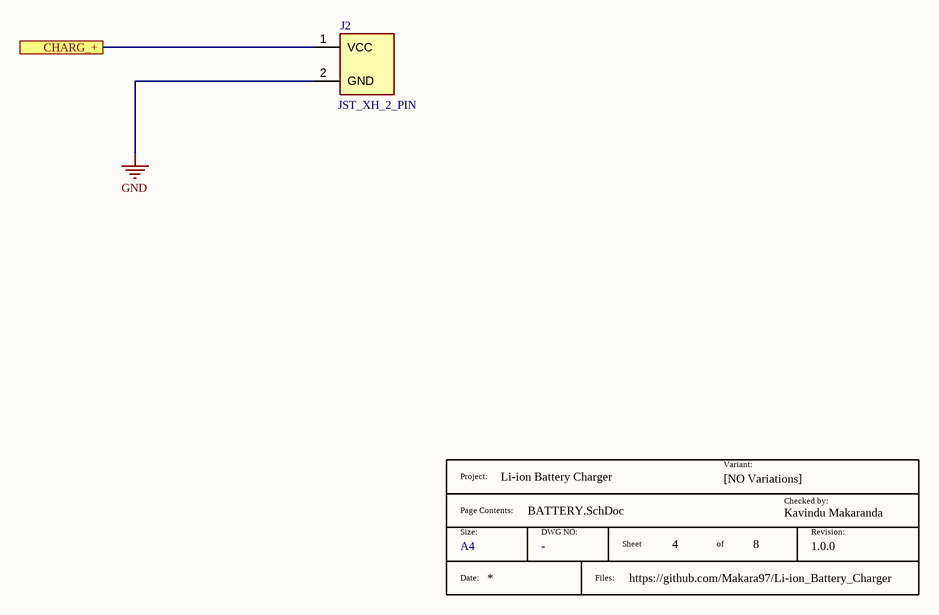
[diagram p7: BATTERY.SchDoc]

### Parts
(Parts that share a designator on the sheet are numbered #1, #2 ... from top to bottom, then left to right.)
*?#7  Size: A4  (hidden comment: TitleBlock)  (graphical)
J2  JST_XH_2_PIN  [B2BXHAGU]

### Ports
CHARG_+ (see Main_sch[3A], CHARGING IC[4B], FUEL GAUGE IC[4B])

### Nets
GND: J2.2(GND)
NetC2_2: J2.1(VCC) ; port CHARG_+

### Notes on the sheet
- THIS DOCUMENT AND THE DATA DISCLOSED HEREIN OR
- HEREWITH IS THE PROPERTY OF ALTIUM LIMITED AND MAY
- DWG NO:
- REVISION
- REV:
- DESCRIPTION
- DATE
- APPROVED
- BE FREELY DISTRIBUTED IN WHOLE. NO RIGHTS ARE
- RESERVED OR EXPRESS OR IMPLIED WARANTEE GIVEN.
- ENG:
- APPROVALS
- PROJECT
- DSN:
- CHK:
- REFERENCE DOCUMENTS
- PROJECT REVISION:
- TITLE
- DOCUMENT REVISION:
- DESIGN ITEM:
- BOM:
- FAB DWG:
- PCB DWG:
- ASSY DWG:
- SCALE:
- A3
- SIZE
- CAGE CODE
- FILE NAME
- DWG NO.
- SHEET
- OF
- REV
- (in symbol TitleBlock) Project:; Variant:; [NO Variations]; Checked by:; Page Contents:; Kavindu Makaranda; Size:; DWG NO:; Sheet; of; Revision:; Date:; Files:

### Library data of the parts
*?#7 = TitleBlock: Standard Title Block; DWG NO: -
J2 = B2B-XH-A-GU: Connector; Manufacturer_Name: JST (JAPAN SOLDERLESS TERMINALS); Datasheet Link: http://www.jst-mfg.com/product/pdf/eng/eXH.pdf; Height: 7mm; Manufacturer_Part_Number: B2B-XH-A-GU; Mouser Part Number: N/A; Mouser Price/Stock: https://www.mouser.co.uk/ProductDetail/JST-Commercial/B2B-XH-A-GU?qs=IKkN%2F947nfBVsqimfO%252BieQ%3D%3D; Arrow Part Number: B2B-XH-A-GU; Arrow Price/Stock: https://www.arrow.com/en/products/b2b-xh-a-gu/jst-manufacturing?utm_currency=USD&region=europe

## Nets that join several sheets
+5: USB (J1.A9 J1.B9 LED1.2), VOLTAGE REGULATOR (C6.2 IC2.1 IC2.3), CHARGING IC (C3.2 IC1.1)
GND: USB (9 pins), VOLTAGE REGULATOR (C6.1 C7.1 IC2.2), CHARGING IC (10 pins), MCU (5 pins), FUEL GAUGE IC (5 pins), DISPLAY (J3.1), BATTERY (J2.2)
4.7v_SUPPLY: VOLTAGE REGULATOR (C7.2 IC2.5), MCU (C10.2 IC3.4 J4.2), FUEL GAUGE IC (R8.2 R9.2 R10.2 R11.2), DISPLAY (J3.2)
ALM: MCU (IC3.15), FUEL GAUGE IC (R10.1 U1.1)
NetC2_2: CHARGING IC (C2.2 IC1.10 L1.2), FUEL GAUGE IC (C8.1 R12.2 U1.9), BATTERY (J2.1)
RSTIO: MCU (IC3.14), FUEL GAUGE IC (R11.1 U1.7)
SCK: MCU (IC3.20), FUEL GAUGE IC (R8.1 U1.3), DISPLAY (J3.3)
SDA: MCU (IC3.1), FUEL GAUGE IC (R9.1 U1.2), DISPLAY (J3.4)